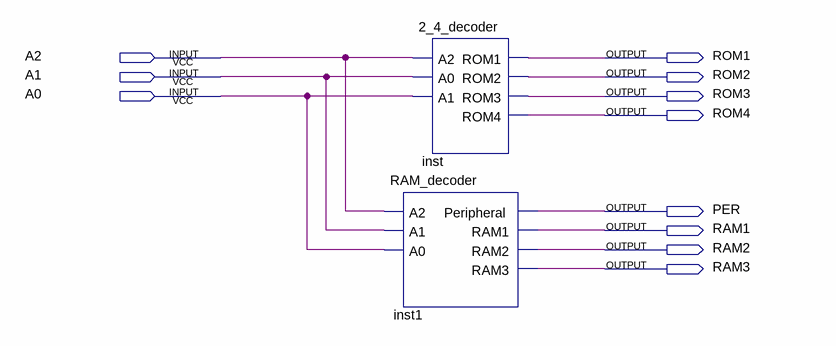
[diagram p0: schematic sheet]
// Quartus schematic decoder.bdf as structural Verilog: 2 symbols, 11 pins
module decoder (
  input  A2,
  input  A1,
  input  A0,
  output ROM1,
  output ROM2,
  output ROM3,
  output ROM4,
  output PER,
  output RAM1,
  output RAM2,
  output RAM3
);

  RAM_decoder inst1 (.A2(A2), .A1(A1), .A0(A0), .Peripheral(PER), .RAM1(RAM1), .RAM2(RAM2), .RAM3(RAM3));
  \2_4_decoder  inst (.A2(A2), .A0(A1), .A1(A0), .ROM1(ROM1), .ROM2(ROM2), .ROM3(ROM3), .ROM4(ROM4));
endmodule
